# EAGLE design aceinna_breakout (EAGLE 9.5.2)

## Sheet 1 of 3: Leg COM
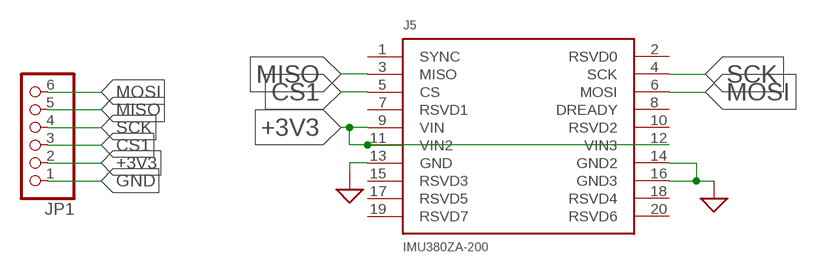
[diagram p0: schematic, sheet 1]

### Parts
J5  IMU380ZA-200  [IMU380-CLM-110-02]
JP1  PINHD-1X6CB  [1X06-CLEANBIG]

### Nets
+3V3: J5.9(VIN) J5.11(VIN2) J5.12(VIN3) JP1.2
CS1: J5.5(CS) JP1.3
GND: J5.13(GND) J5.14(GND2) J5.16(GND3) JP1.1 ; supply symbol labelled SUP
MISO: J5.3(MISO) JP1.5
MOSI: J5.6(MOSI) JP1.6
SCK: J5.4(SCK) JP1.4
Unconnected: J5.1(SYNC) J5.2(RSVD0) J5.7(RSVD1) J5.8(DREADY) J5.10(RSVD2) J5.15(RSVD3) J5.17(RSVD5) J5.18(RSVD4) J5.19(RSVD7) J5.20(RSVD6)

## Sheet 2 of 3: Connectors

## Sheet 3 of 3: UP Board

## Library data of the parts
J5 = mylib:IMU380ZA-200: LOW PROFILE 1MMX1MM DOUBLE ROW BODY. MANUFACTURER:SAMTEC.
JP1 = adafruit:PINHD-1X6: PIN HEADER

## Board
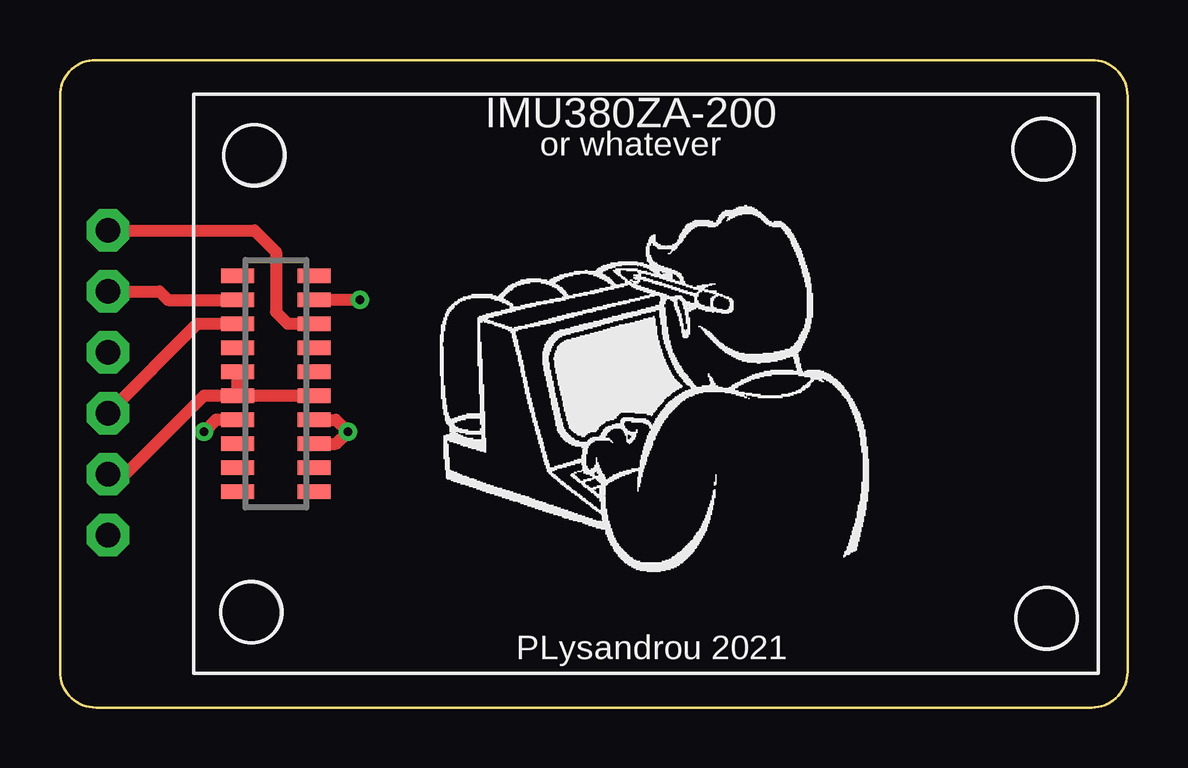
[diagram p1: board, top side]
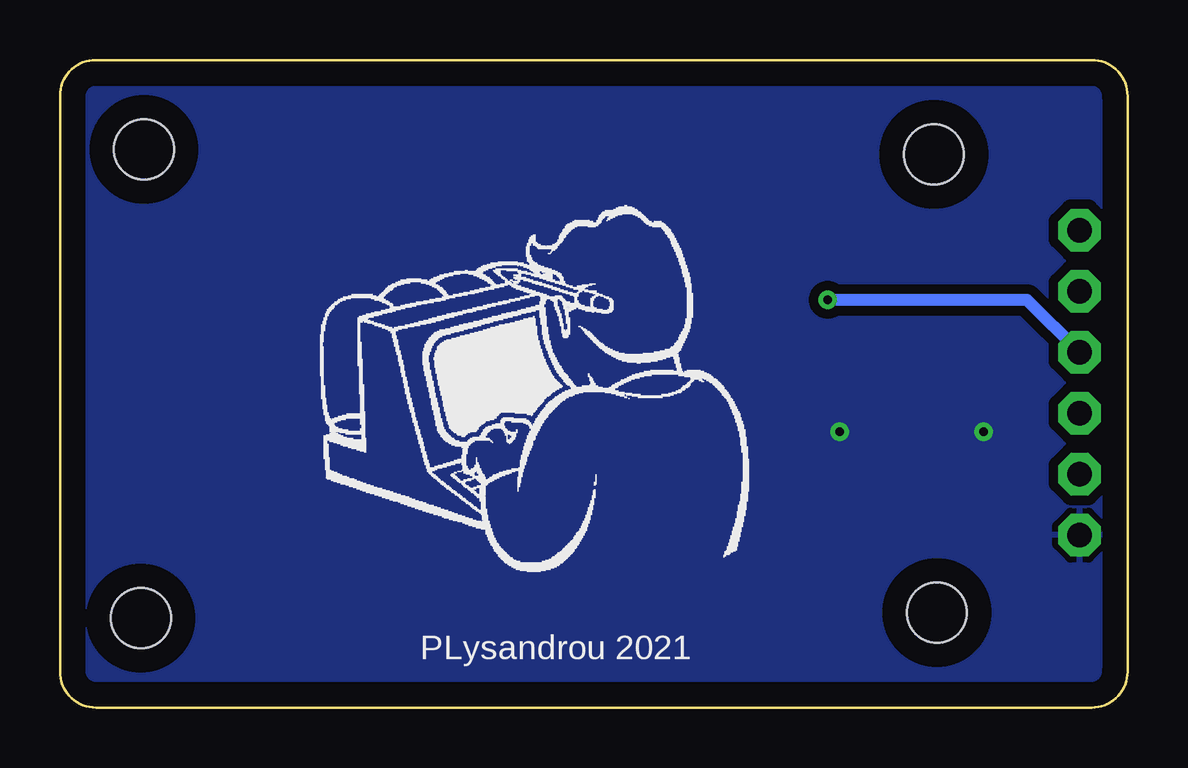
[diagram p2: board, bottom side, seen from below]

Size 44.5 x 27 mm. Coordinates in mm from the lower left corner, seen from the top.
Outline: 0,1.5 arc90 1.5,0 43,0 arc90 44.5,1.5 44.5,25.5 arc90 43,27 1.5,27 arc90 0,25.5 0,1.5
Copper layers (1*16): Top 0.035mm / dielectric 1.5mm / Bottom 0.035mm
Design rules "default *": minimum track width 6mil, minimum drill 0.3mm, track to track 6mil, track to pad 6mil, pad to pad 6mil, via to via 6mil, smd to smd 6mil, copper to edge 40mil, drill to drill 6mil, minimum pad ring 10mil, minimum via ring 8mil, stop-mask expansion 4mil, vias tented up to drill 0mil, thermal gap 10mil

### Footprints (pad centres in the part's own frame; a part is rotated, then mirrored left to right if it is on the bottom)
IMU380-CLM-110-02 = smd 0.61 x 1.372: 1 4.503,1.6; 2 4.503,-1.6; 3 3.503,1.6; 4 3.503,-1.6; 5 2.502,1.6; 6 2.502,-1.6; 7 1.501,1.6; 8 1.501,-1.6; 9 0.5,1.6; 10 0.5,-1.6; 11 -0.5,1.6; 12 -0.5,-1.6; 13 -1.501,1.6; 14 -1.501,-1.6; 15 -2.502,1.6; 16 -2.502,-1.6; 17 -3.503,1.6; 18 -3.503,-1.6; 19 -4.503,1.6; 20 -4.503,-1.6 | hole 2.5: -9.538,1.054; 9.563,0.927; -9.766,-32.131; 9.766,-32.004
1X06-CLEANBIG = drill 1.016 pad 1.778 octagon: 1 -6.35,0; 2 -3.81,0; 3 -1.27,0; 4 1.27,0; 5 3.81,0; 6 6.35,0

### Placement (x,y rotation side)
J5  9,13.5 90 top
JP1  2,13.54 90 top

### Tracks (layer width: path | path; a pad name or v marks a point on that pad's centre or on a via)
+3V3
  Top 0.508: J5.11 6,13 2.73,9.73 JP1.2 | J5.11 J5.9 | J5.12 J5.11
CS1
  Top 0.508: JP1.3 5.73,16 J5.5
GND  (via drill 0.35)
  Top 0.508: J5.14 11.5,12 v12,11.5 11.5,11 J5.16 | J5.13 6.5,12 v6,11.5
  pour Bottom (isolate 0.406): -3,28.5 -3,0 0.5,-3.5 45,-3.5 49.5,1 49.5,25.5 45,30 -1.5,30
MISO
  Top 0.508: JP1.5 4.15,17.35 4.5,17 J5.3
MOSI
  Top 0.508: JP1.6 8.11,19.89 9,19 9,16.5 9.5,16 J5.6
SCK  (via drill 0.35)
  Top 0.508: v12.5,17 J5.4
  Bottom 0.508: JP1.4 4.19,17 v12.5,17

### Text on the board
tNames: or whatever | PLysandrou 2021
bNames: PLysandrou 2021